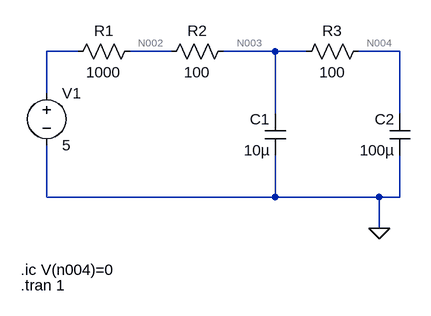
[diagram p0: schematic Original.asc]
Original.asc, the LTspice schematic file:
Version 4
SHEET 1 880 680
WIRE -144 48 -192 48
WIRE 0 48 -64 48
WIRE 160 48 80 48
WIRE 208 48 160 48
WIRE 352 48 288 48
WIRE -192 112 -192 48
WIRE 160 144 160 48
WIRE 352 144 352 48
WIRE -192 272 -192 192
WIRE 160 272 160 208
WIRE 160 272 -192 272
WIRE 320 272 160 272
WIRE 352 272 352 208
WIRE 352 272 320 272
WIRE 320 320 320 272
FLAG 320 320 0
SYMBOL cap 176 208 R180
WINDOW 0 24 56 Left 2
WINDOW 3 24 8 Left 2
SYMATTR InstName C1
SYMATTR Value 10µ
SYMBOL cap 368 208 R180
WINDOW 0 24 56 Left 2
WINDOW 3 24 8 Left 2
SYMATTR InstName C2
SYMATTR Value 100µ
SYMBOL res -48 32 R90
WINDOW 0 0 56 VBottom 2
WINDOW 3 32 56 VTop 2
SYMATTR InstName R1
SYMATTR Value 1000
SYMBOL res 96 32 R90
WINDOW 0 0 56 VBottom 2
WINDOW 3 32 56 VTop 2
SYMATTR InstName R2
SYMATTR Value 100
SYMBOL res 304 32 R90
WINDOW 0 0 56 VBottom 2
WINDOW 3 32 56 VTop 2
SYMATTR InstName R3
SYMATTR Value 100
SYMBOL voltage -192 96 R0
SYMATTR InstName V1
SYMATTR Value 5
TEXT -232 384 Left 2 !.ic V(n004)=0
TEXT -232 408 Left 2 !.tran 1

The netlist it stands for:
* Original.asc
C1 0 N003 10µ
C2 0 N004 100µ
R1 N002 N001 1000
R2 N003 N002 100
R3 N004 N003 100
V1 N001 0 5
.ic V(n004)=0
.tran 1
.backanno
.end

* Results of the author's LTspice run, read from the files saved beside the schematic
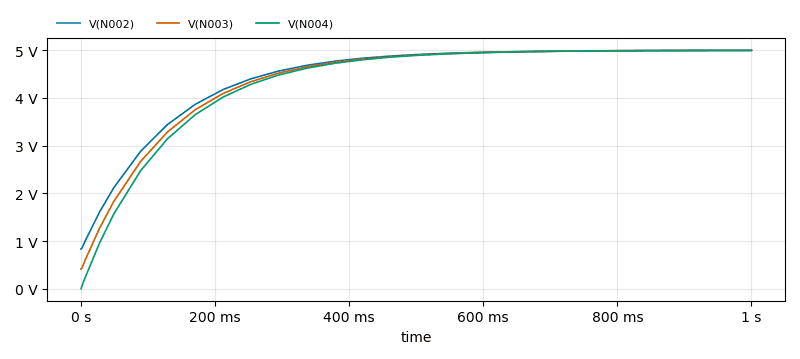
[diagram p1: Transient Analysis of Original.asc, plotted from the saved traces]
* Transient Analysis, 1 run:
*   V(N002): min 833.3 mV, max 4.998 V, average 4.451 V, rms 4.547 V, last 4.998 V
*   V(N003): min 416.7 mV, max 4.998 V, average 4.396 V, rms 4.514 V, last 4.998 V
*   V(N004): min 0 V, max 4.998 V, average 4.346 V, rms 4.485 V, last 4.998 V